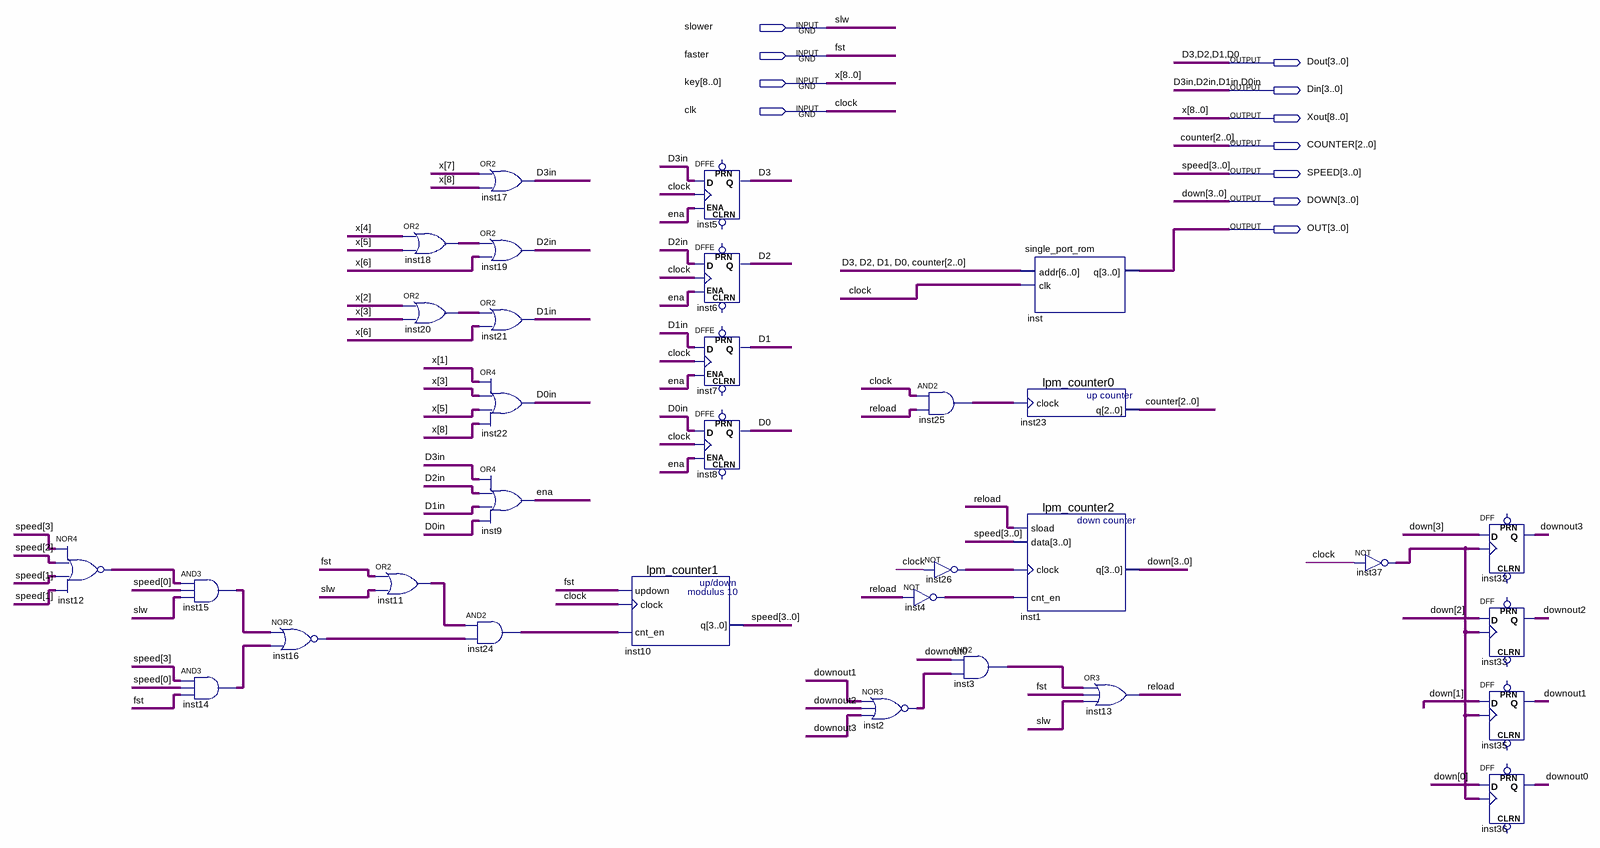
[diagram p0: schematic sheet]
// Quartus schematic sapr2.bdf as structural Verilog: 32 symbols, 11 pins
module sapr2 (
  input  slower,
  input  faster,
  input  [8:0] key,
  input  clk,
  output [3:0] Dout,
  output [3:0] Din,
  output [8:0] Xout,
  output [2:0] COUNTER,
  output [3:0] SPEED,
  output [3:0] DOWN,
  output [3:0] OUT
);

  wire downout0, downout1, downout2, downout3, ena, inst2_out, inst3_out, inst4_out, inst11_out, inst12_out,
       inst14_out, inst15_out, inst16_out, inst18_out, inst20_out, inst24_out, inst25_out, inst26_out,
       inst37_out, reload;

  nor inst12 (inst12_out, SPEED[3], SPEED[2], SPEED[1], SPEED[1]);
  and inst15 (inst15_out, inst12_out, SPEED[0], slower);
  and inst14 (inst14_out, SPEED[3], SPEED[0], faster);
  nor inst16 (inst16_out, inst15_out, inst14_out);
  or inst11 (inst11_out, faster, slower);
  or inst18 (inst18_out, key[4], key[5]);
  or inst20 (inst20_out, key[2], key[3]);
  or inst17 (Din[3], key[7], key[8]);
  or inst19 (Din[2], inst18_out, key[6]);
  or inst21 (Din[1], inst20_out, key[6]);
  or inst22 (Din[0], key[1], key[3], key[5], key[8]);
  or inst9 (ena, Din[3], Din[2], Din[1], Din[0]);
  and inst24 (inst24_out, inst11_out, inst16_out);
  lpm_counter1 inst10 (.updown(faster), .clock(clk), .cnt_en(inst24_out), .q(SPEED));
  DFFE inst5 (.D(Din[3]), .CLK(clk), .ENA(ena), .Q(Dout[3]));  // open: PRN, CLRN
  DFFE inst6 (.D(Din[2]), .CLK(clk), .ENA(ena), .Q(Dout[2]));  // open: PRN, CLRN
  DFFE inst7 (.D(Din[1]), .CLK(clk), .ENA(ena), .Q(Dout[1]));  // open: PRN, CLRN
  DFFE inst8 (.D(Din[0]), .CLK(clk), .ENA(ena), .Q(Dout[0]));  // open: PRN, CLRN
  nor inst2 (inst2_out, downout1, downout2, downout3);
  and inst25 (inst25_out, clk, reload);
  not inst26 (inst26_out, clk);
  not inst4 (inst4_out, reload);
  and inst3 (inst3_out, downout0, inst2_out);
  single_port_rom inst (.addr({Dout, COUNTER}), .clk(clk), .q(OUT));
  lpm_counter0 inst23 (.clock(inst25_out), .q(COUNTER));
  lpm_counter2 inst1 (.sload(reload), .data(SPEED), .clock(inst26_out), .cnt_en(inst4_out), .q(DOWN));
  or inst13 (reload, inst3_out, faster, slower);
  not inst37 (inst37_out, clk);
  DFF inst32 (.CLK(inst37_out), .D(DOWN[3]), .Q(downout3));  // open: CLRN, PRN
  DFF inst33 (.CLK(inst37_out), .D(DOWN[2]), .Q(downout2));  // open: CLRN, PRN
  DFF inst35 (.CLK(inst37_out), .D(DOWN[1]), .Q(downout1));  // open: CLRN, PRN
  DFF inst36 (.CLK(inst37_out), .D(DOWN[0]), .Q(downout0));  // open: CLRN, PRN

  assign Xout = key;

  // Other names for the same wires on the sheet: clock = clk; D0 = Dout[0]; D0in = Din[0]; D1 = Dout[1];
  //   D1in = Din[1]; D2 = Dout[2]; D2in = Din[2]; D3 = Dout[3]; D3in = Din[3]; fst = faster; slw = slower;
  //   x[8:0] = key
endmodule
